# Altium schematic sheet 4_Power.SCHDOC
size 297 x 209 mm; SheetNumber: 11; SheetTotal: 18; DocumentName: 4_Power.SCHDOC
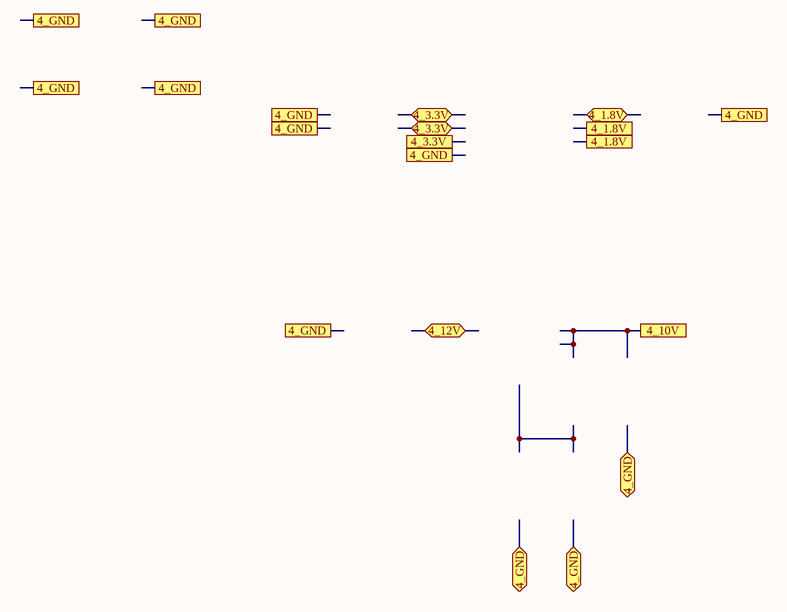
[diagram p0: 4_Power.SCHDOC]

## Ports
4_1.8V, 4_1.8V (bidir), 4_3.3V, 4_3.3V (bidir), 4_10V, 4_12V (bidir), 4_GND

## Notes on the sheet
- A
- B
- C
- D
- 1
- 2
- 3
- Title
- 4
- Size
- A4
- Number
- Rev
- Date
- Filename
- Drawn by
- Sheet
- of